# EAGLE design RW_CAN Swerve (EAGLE 9.4.2)
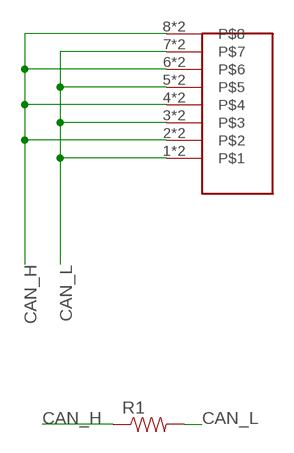
[diagram p0: schematic, sheet 1]

## Parts
R1  RESISTOR1206  [1206]
U$1  WEIDMULLERSF-3_50--8-180  [LSF_8_180]

## Nets
CAN_H: R1.1 U$1.2 U$1.4 U$1.6 U$1.8 U$1.12 U$1.14 U$1.16 U$1.18
CAN_L: R1.2 U$1.1 U$1.3 U$1.5 U$1.7 U$1.11 U$1.13 U$1.15 U$1.17

## Library data of the parts
R1 = SparkFun-Passives:RESISTOR: Resistor Basic schematic elements and footprints for 0603, 1206, and PTH resistors.
U$1 = PhoenixContact:WEIDMULLERSF-3_50--8-180

## Board
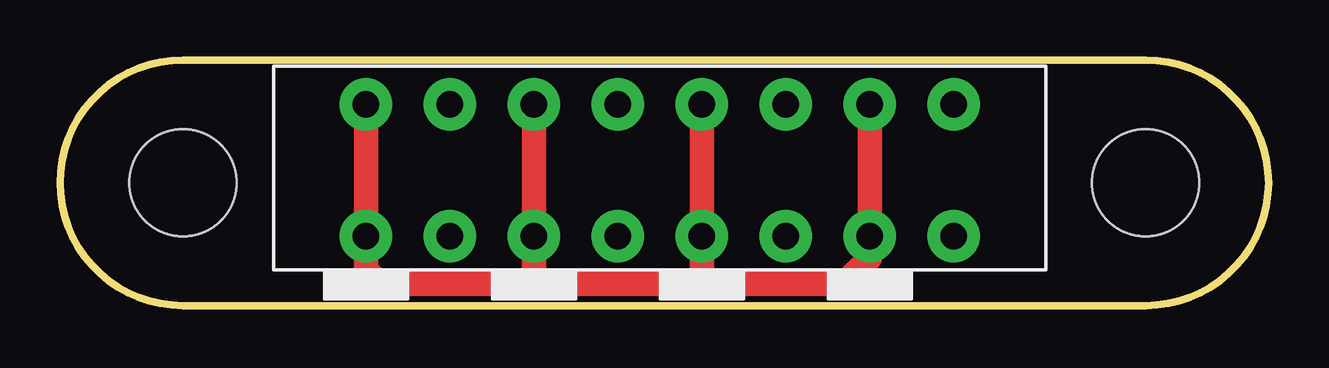
[diagram p1: board, top side]
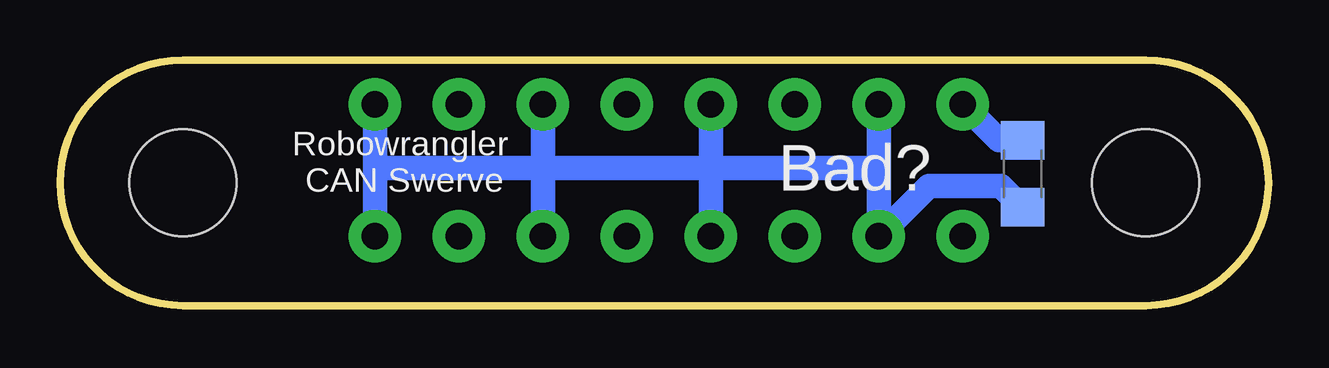
[diagram p2: board, bottom side, seen from below]

Size 50.38 x 10.25 mm. Coordinates in mm from the lower left corner, seen from the top.
Outline: 5.12,10.25 45.25,10.25 arc-90 50.38,5.12 arc-90 45.25,0 5.12,0 arc-90 0,5.12 arc-90 5.12,10.25
Copper layers (1*16): Top 0.035mm / dielectric 1.5mm / Bottom 0.035mm
Design rules "SeeedStudio_2layer_DRU_no_angle_20140221": minimum track width 6mil, minimum drill 12mil, track to track 6mil, track to pad 6mil, pad to pad 6mil, via to via 6mil, smd to smd 0mil, copper to edge 10mil, drill to drill 10mil, minimum pad ring 10mil, minimum via ring 6mil, stop-mask expansion 2mil, vias tented up to drill 100mil, thermal gap 10mil
Holes 4.45 mm at 5.12,5.12 45.25,5.12

### Footprints (pad centres in the part's own frame; a part is rotated, then mirrored left to right if it is on the bottom)
1206 = smd 1.6 x 1.8: 1 -1.4,0; 2 1.4,0
LSF_8_180 = drill 1.1 pad 2.184: 1 -12.25,-2.85; 2 -8.75,-2.85; 3 -5.25,-2.85; 4 -1.75,-2.85; 5 1.75,-2.85; 6 5.25,-2.85; 7 8.75,-2.85; 8 12.25,-2.85; 11 -12.25,2.65; 12 -8.75,2.65; 13 -5.25,2.65; 14 -1.75,2.65; 15 1.75,2.65; 16 5.25,2.65; 17 8.75,2.65; 18 12.25,2.65

### Placement (x,y rotation side)
R1  10.25,5.5 90 bottom
U$1  25,5.75 0 top

### Tracks (layer width: path | path; a pad name or v marks a point on that pad's centre or on a via)
CAN_H
  Bottom 1.016: U$1.12 16.25,5.75 | 16.25,5.75 U$1.2 14.15,5 11.15,5 R1.1 | 30.25,6.9 U$1.16 30.25,5.75 | 23.25,7.9 U$1.14 23.25,5.75 | 37.25,8.5 U$1.18 37.25,5.75 | U$1.4 23.25,5.75 | U$1.6 30.25,5.75 | U$1.8 37.25,5.75 | 16.25,5.75 23.25,5.75 | 23.25,5.75 30.25,5.75 | 30.25,5.75 37.25,5.75
CAN_L
  Top 1.016: U$1.11 U$1.1 12.75,1.5 13.34,0.91 19.75,0.91 | 19.75,0.91 26.75,0.91 | 26.75,0.91 32.66,0.91 33.75,2 U$1.7 U$1.17 | U$1.15 U$1.5 26.75,0.91 | U$1.13 U$1.3 19.75,0.91
  Bottom 1.016: U$1.11 11.25,6.9 R1.2

### Text on the board
bNames: Bad? | Robowrangler / CAN Swerve
tValues: 2020/02/06